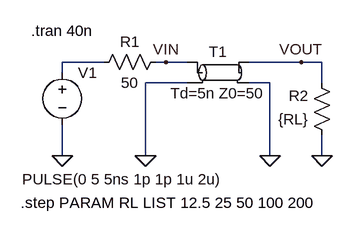
[diagram p0: schematic fig-02-04-11.asc]
fig-02-04-11.asc, the LTspice schematic file:
Version 4
SHEET 1 880 680
WIRE 64 96 0 96
WIRE 160 96 144 96
WIRE 192 96 160 96
WIRE 368 96 288 96
WIRE 400 96 368 96
WIRE 0 112 0 96
WIRE 192 128 128 128
WIRE 320 128 288 128
WIRE 400 128 400 96
WIRE 0 240 0 192
WIRE 128 240 128 128
WIRE 320 240 320 128
WIRE 400 240 400 208
FLAG 0 240 0
FLAG 128 240 0
FLAG 400 240 0
FLAG 320 240 0
FLAG 160 96 VIN
FLAG 368 96 VOUT
SYMBOL voltage 0 96 R0
WINDOW 3 -62 180 Left 2
WINDOW 123 0 0 Left 2
WINDOW 39 0 0 Left 2
SYMATTR Value PULSE(0 5 5ns 1p 1p 1u 2u)
SYMATTR InstName V1
SYMBOL tline 240 112 R0
SYMATTR InstName T1
SYMATTR Value Td=5n Z0=50
SYMBOL res 160 80 R90
WINDOW 0 0 56 VBottom 2
WINDOW 3 32 56 VTop 2
SYMATTR InstName R1
SYMATTR Value 50
SYMBOL res 416 224 R180
WINDOW 0 36 76 Left 2
WINDOW 3 36 40 Left 2
SYMATTR InstName R2
SYMATTR Value {RL}
TEXT -48 48 Left 2 !.tran 40n
TEXT -64 312 Left 2 !.step PARAM RL LIST 12.5 25 50 100 200

The netlist it stands for:
* fig-02-04-11.asc
V1 N001 0 PULSE(0 5 5ns 1p 1p 1u 2u)
T1 VIN 0 VOUT 0 Td=5n Z0=50
R1 VIN N001 50
R2 0 VOUT {RL}
.tran 40n
.step PARAM RL LIST 12.5 25 50 100 200
.backanno
.end